# EAGLE design V0p2_Main_PCB2 (EAGLE 6.5.0)
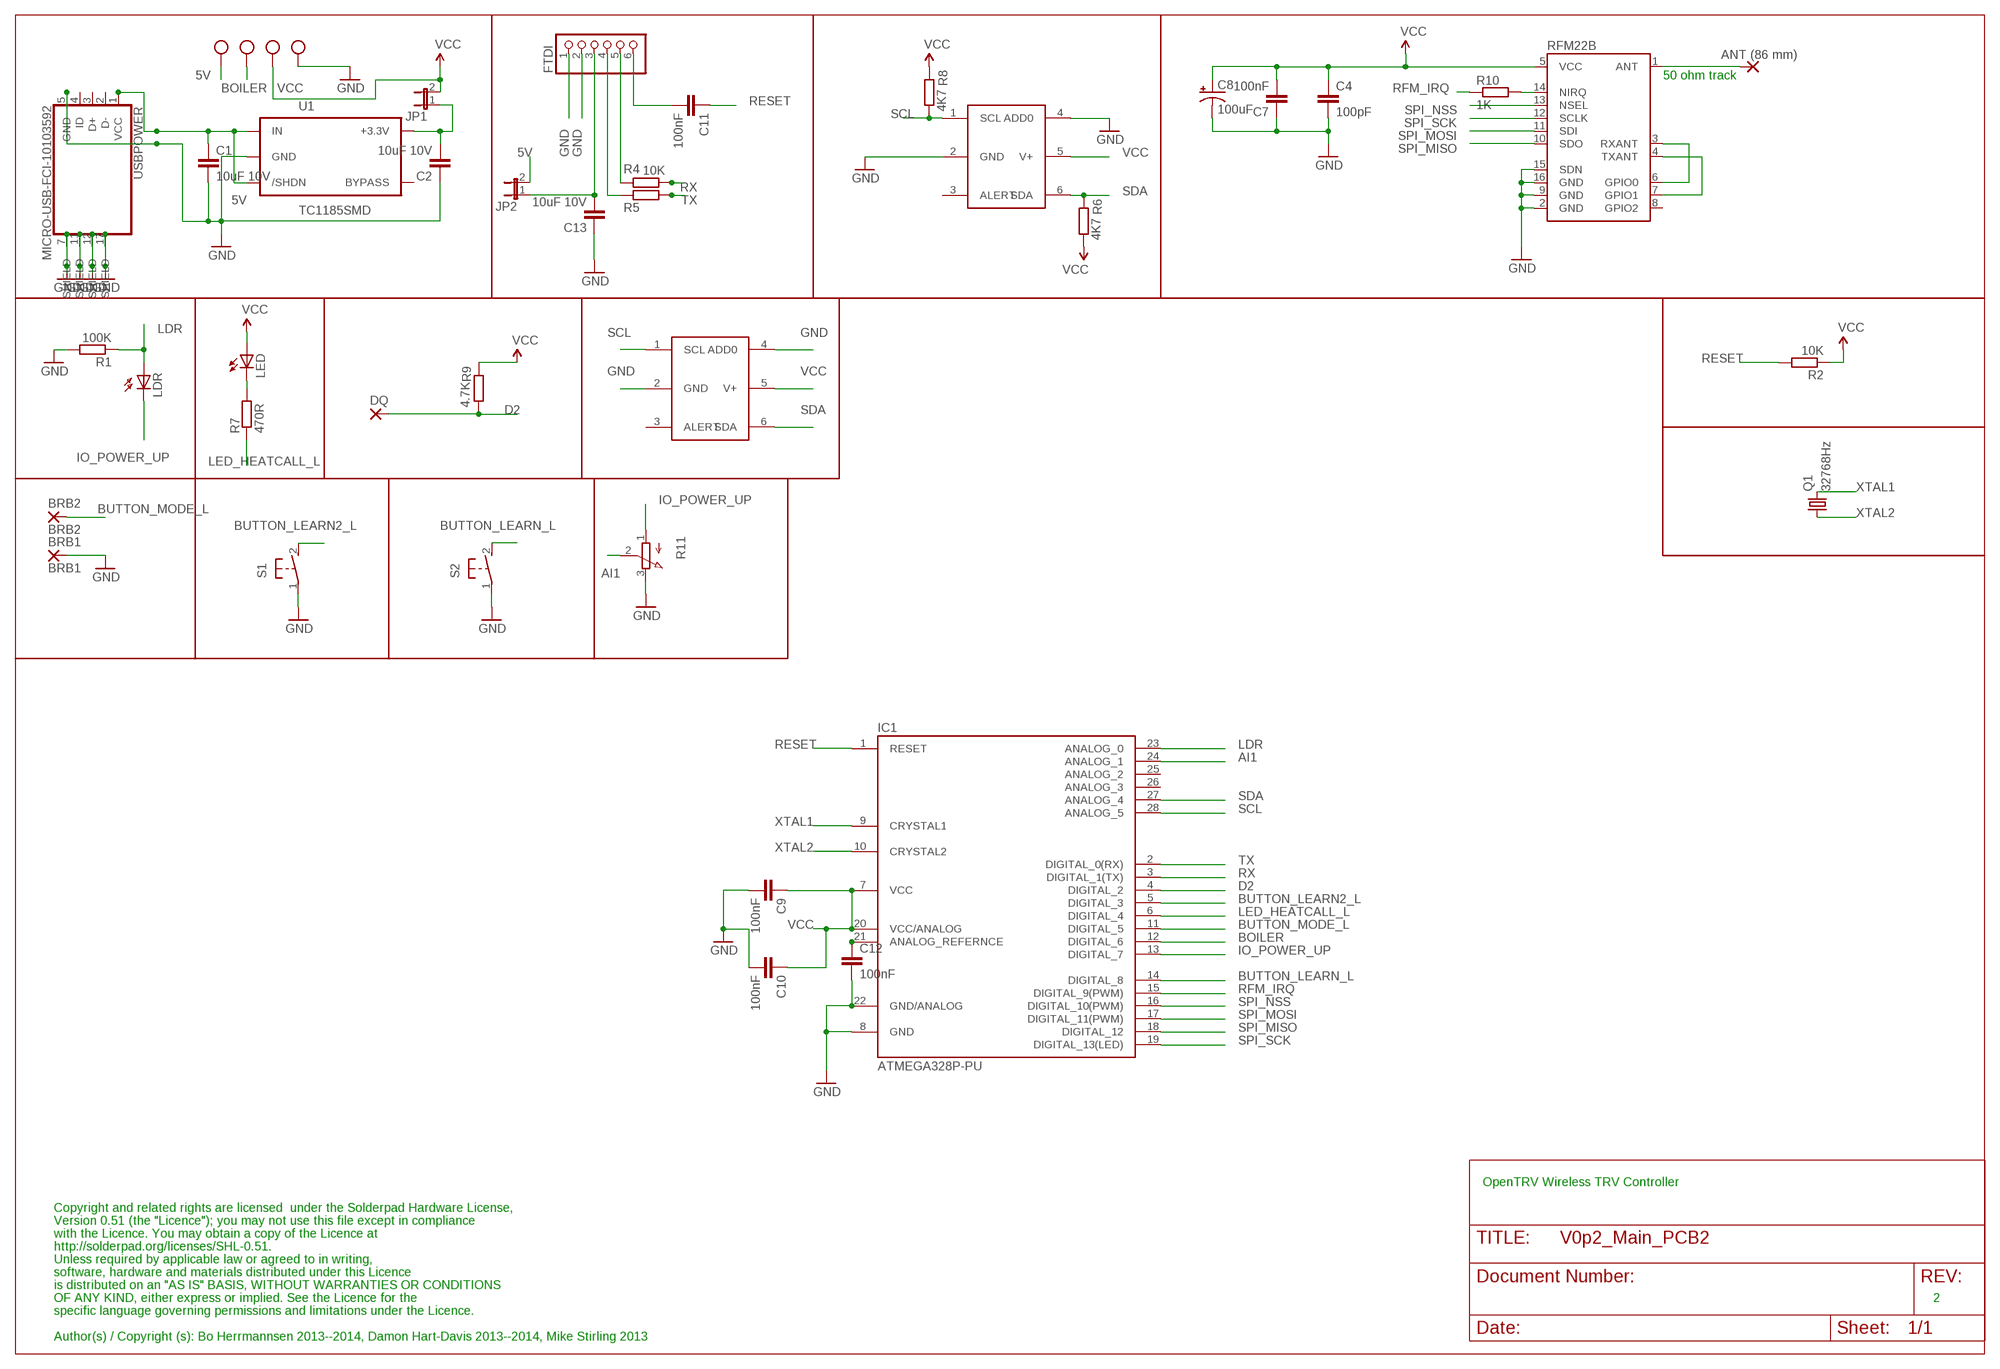
[diagram p0: schematic, sheet 1]

## Parts
ANT  ANT (86 mm)  2,15/1,0  [2,15/1,0]
BRB1  BRB1  2,15/1,0  [2,15/1,0]
BRB2  BRB2  2,15/1,0  [2,15/1,0]
C1  10uF 10V  CAP0603-CAP  [0603-CAP]
C2  10uF 10V  CAP0603-CAP  [0603-CAP]
C4  100pF  CAP0603-CAP  [0603-CAP]
C7  100nF  CAP0603-CAP  [0603-CAP]
C8  100uF  CAP_POL1206  [EIA3216]
C9  100nF  CAP0603-CAP  [0603-CAP]
C10  100nF  CAP0603-CAP  [0603-CAP]
C11  100nF  CAP0603-CAP  [0603-CAP]
C12  100nF  CAP0603-CAP  [0603-CAP]
C13  10uF 10V  CAP0603-CAP  [0603-CAP]
DQ  2,15/1,0  [2,15/1,0]
FTDI  PINHD-1X6/90  [1X06/90]
IC1  ATMEGA328P-PU  ATMEGA8-PU  [DIL28-3]
JP1  JP1E  [JP1]
JP2  JP1E  [JP1]
LDR  BPX65  [BPX65]
LED  LED3MM  [LED3MM]
Q1  32768Hz  MC-306  [MC-306]
R1  100K  R-EU_R0603  [R0603]
R2  10K  R-EU_R0603  [R0603]
R4  10K  R-EU_R0603  [R0603]
R5  10K  R-EU_R0603  [R0603]
R6  4K7  R-EU_R0603  [R0603]
R7  470R  R-EU_R0603  [R0603]
R8  4K7  R-EU_R0603  [R0603]
R9  4.7K  R-EU_R0603  [R0603]
R10  1K  R-EU_R0603  [R0603]
R11  EVUE2A  [EVUE]
RFM22B  RFM22SMD  [RFM22-XXX-S2]
S1  31-XX  [B3F-31XX]
S2  31-XX  [B3F-31XX]
TMP1  TMP1  TMP112  [TMP112]
TMP2  TMP2  TMP112  [TMP112]
U1  TC1185SMD  [TC1185]
USBPOWER  MICRO-USB-FCI-10103592  [MICRO-USB-FCI-10103592]
X1  W237-102  [SCREWTERMINAL]
X2  W237-102  [SCREWTERMINAL]

## Nets
5V [supply]: C1.1 JP2.2 U1.1(IN) U1.3(/SHDN) USBPOWER.1(VCC) X1.2
AI1: IC1.24(ANALOG_1) R11.2(S)
BOILER: IC1.12(DIGITAL_6) X1.1
BUTTON_LEARN2_L: IC1.5(DIGITAL_3) S1.2(S)
BUTTON_LEARN_L: IC1.14(DIGITAL_8) S2.2(S)
BUTTON_MODE_L: BRB2.1(P) IC1.11(DIGITAL_5)
D2: DQ.1(P) IC1.4(DIGITAL_2) R9.1
GND [supply]: BRB1.1(P) C1.2 C2.1 C4.2 C7.1 C8.C(-) C9.2 C10.2 C12.2 C13.1 FTDI.1 FTDI.2 IC1.8(GND) IC1.22(GND/ANALOG) R1.2 R11.3(E) RFM22B.2(GND) RFM22B.9(GND) RFM22B.15(SDN) RFM22B.16(GND) S1.1(P) S2.1(P) TMP1.2(GND) TMP1.4(ADD0) TMP2.2(GND) TMP2.4(ADD0) U1.2(GND) USBPOWER.5(GND) USBPOWER.7(SHIELD) USBPOWER.11(SHIELD) USBPOWER.12(SHIELD) USBPOWER.17(SHIELD) X2.2
IO_POWER_UP [supply]: IC1.13(DIGITAL_7) LDR.K(C) R11.1(A)
LDR: IC1.23(ANALOG_0) LDR.A R1.1
LED_HEATCALL_L: IC1.6(DIGITAL_4) R7.1
N$1: C11.2 FTDI.6
N$3: FTDI.4 R5.2
N$5: FTDI.5 R4.2
N$6 [supply]: C12.1 IC1.21(ANALOG_REFERNCE)
N$7: R10.2 RFM22B.14(NIRQ)
N$8 [supply]: C2.2 JP1.1 U1.5(+3.3V)
N$11 [supply]: C13.2 FTDI.3 JP2.1
N$13: LED.K(C) R7.2
N$20: RFM22B.3(RXANT) RFM22B.6(GPIO0)
N$21: RFM22B.4(TXANT) RFM22B.7(GPIO1)
N$26 [ant]: ANT.1(P) RFM22B.1(ANT)
RESET: C11.1 IC1.1(RESET) R2.2
RFM_IRQ: IC1.15(DIGITAL_9(PWM)) R10.1
RX: IC1.3(DIGITAL_1(TX)) R4.1
SCL: IC1.28(ANALOG_5) R8.1 TMP1.1(SCL) TMP2.1(SCL)
SDA: IC1.27(ANALOG_4) R6.2 TMP1.6(SDA) TMP2.6(SDA)
SPI_MISO: IC1.18(DIGITAL_12) RFM22B.10(SDO)
SPI_MOSI: IC1.17(DIGITAL_11(PWM)) RFM22B.11(SDI)
SPI_NSS: IC1.16(DIGITAL_10(PWM)) RFM22B.13(NSEL)
SPI_SCK: IC1.19(DIGITAL_13(LED)) RFM22B.12(SCLK)
TX: IC1.2(DIGITAL_0(RX)) R5.1
VCC [supply]: C4.1 C7.2 C8.A(+) C9.1 C10.1 IC1.7(VCC) IC1.20(VCC/ANALOG) JP1.2 LED.A R2.1 R6.1 R8.2 R9.2 RFM22B.5(VCC) TMP1.5(V+) TMP2.5(V+) X2.1
XTAL1: IC1.9(CRYSTAL1) Q1.4
XTAL2: IC1.10(CRYSTAL2) Q1.1
Unconnected: IC1.25(ANALOG_2) IC1.26(ANALOG_3) RFM22B.8(GPIO2) TMP1.3(ALERT) TMP2.3(ALERT) U1.4(BYPASS) USBPOWER.2(D-) USBPOWER.3(D+) USBPOWER.4(ID)

## Notes on the sheet
- 50 ohm track
- OpenTRV Wireless TRV Controller
- Copyright and related rights are licensed  under the Solderpad Hardware License,
- Version 0.51 (the "Licence"); you may not use this file except in compliance
- with the Licence. You may obtain a copy of the Licence at
- http://solderpad.org/licenses/SHL-0.51.
- Unless required by applicable law or agreed to in writing,
- software, hardware and materials distributed under this Licence
- is distributed on an "AS IS" BASIS, WITHOUT WARRANTIES OR CONDITIONS
- OF ANY KIND, either express or implied. See the Licence for the | 2
- specific language governing permissions and limitations under the Licence.
- Author(s) / Copyright (s): Bo Herrmannsen 2013--2014, Damon Hart-Davis 2013--2014, Mike Stirling 2013

## Library data of the parts
ANT BRB1 BRB2 DQ = wirepad:2,15/1,0: THROUGH-HOLE PAD
C1 C2 C4 C7 C9-C13 = SparkFun-Passives:CAP: Capacitor Standard 0603 ceramic capacitor, and 0.1" leaded capacitor.
C8 = SparkFun-Passives:CAP_POL: Capacitor Polarized These are standard SMD and PTH capacitors. Normally 10uF, 47uF, and 100uF in electrolytic and tantalum varieties. Always verify the external diameter of the through hole cap, it varies with capacity, voltage, and manufacturer. The EIA devices should be standard.
FTDI = pinhead:PINHD-1X6: PIN HEADER
IC1 = Arduino-AVR:ATMEGA8-PU
JP1 JP2 = jumper:JP1E: JUMPER
LDR = opto-trans-siemens:BPX65: PHOTO DIODE; MPN: BPX65.; OC_FARNELL: 327451; OC_NEWARK: 06WX2764
LED = adafruit:LED: LED OSRAM: - CHIPLED LG R971, LG N971, LY N971, LG Q971, LY Q971, LO R971, LY R971 LH N974, LH R974 LS Q976, LO Q976, LY Q976 LO Q996 - Hyper CHIPLED LW Q18S LB Q993, LB Q99A, LB R99A - SideLED LS A670, LO A670, LY A670, LG A670, LP A670 LB A673, LV A673, LT A673, LW A673 LH A674 LY A675 LS A676, LA A676, LO A676, LY A676, LW A676 LS A679, LY A679, LG A679 - Hyper Micro SIDELED® LS Y876, LA Y876, LO Y876, LY Y876 LT Y87S - SmartLED LW L88C, LW L88S LB L89C, LB L89S, LG L890 LS L89K, LO L89K, LY L89K LS L896, LA L896, LO L896, LY L896 - TOPLED LS T670, LO T670, LY T670, LG T670, LP T670 LSG T670, LSP T670, LSY T670, LOP T670, LYG T670 LG T671, LOG T671, LSG T671 LB T673, LV T673, LT T673, LW T673 LH T674 LS T676, LA T676, LO T676, LY T676, LB T676, LH T676, LSB T676, LW T676 LB T67C, LV T67C, LT T67C, LS T67K, LO T67K, LY T67K, LW E67C LS E67B, LA E67B, LO E67B, LY E67B, LB E67C, LV E67C, LT E67C LW T67C LS T679, LY T679, LG T679 LS T770, LO T770, LY T770, LG T770, LP T770 LB T773, LV T773, LT T773, LW T773 LH T774 LS E675, LA E675, LY E675, LS T675 LS T776, LA T776, LO T776, LY T776, LB T776 LHGB T686 LT T68C, LB T68C - Hyper Mini TOPLED® LB M676 - Mini TOPLED Santana® LG M470 LS M47K, LO M47K, LY M47K Source: http://www.osram.convergy.de/
Q1 = crystal:MC-306: kHz RANGE CRYSTAL UNIT SMD Source: MC-306_405_406_E07X.PDF Homepage <http://www.epsontoyocom.co.jp>; MPN: MC-306 60.0KHZ 100PPM ,12.5PF; OC_FARNELL: 1278040; OC_NEWARK: 31M5576
R1 R2 R4-R10 = resistor:R-EU_: RESISTOR, European symbol
R11 = pot:EVU: 9 mm Square Rotary Potentiometers Source: Panasonic
RFM22B = SparkFun-RF:RFM22: The RFM22 is a low-power, low cost radio that is capable of operating in the 434MHz and 900MHz open bands. It's frequency is software defined and there are some very good libraries written for it.
S1 S2 = adafruit:31-XX: OMRON SWITCH Now with beefier pads!
TMP1 = TMP112:TMP112
TMP2 = TMP112_2:TMP112
U1 = 3.3VREG:TC1185
USBPOWER = micro-usb-fci-10103592:MICRO-USB-FCI-10103592: Micro USB B Connector RS No: 714-2334 MRF No: 10103592-0001LF
X1 X2 = screwterminal:W237-102: Screw terminal 3.5mm Pitch RS No: 710-0444 MRF No:1776275-2; MPN: 237-102; OC_FARNELL: unknown; OC_NEWARK: 70K9898

## Net classes
0 default: width 0.203 mm
1 supply: width 0.406 mm, clearance 0.203 mm
2 ant: width 2.184 mm

## Board
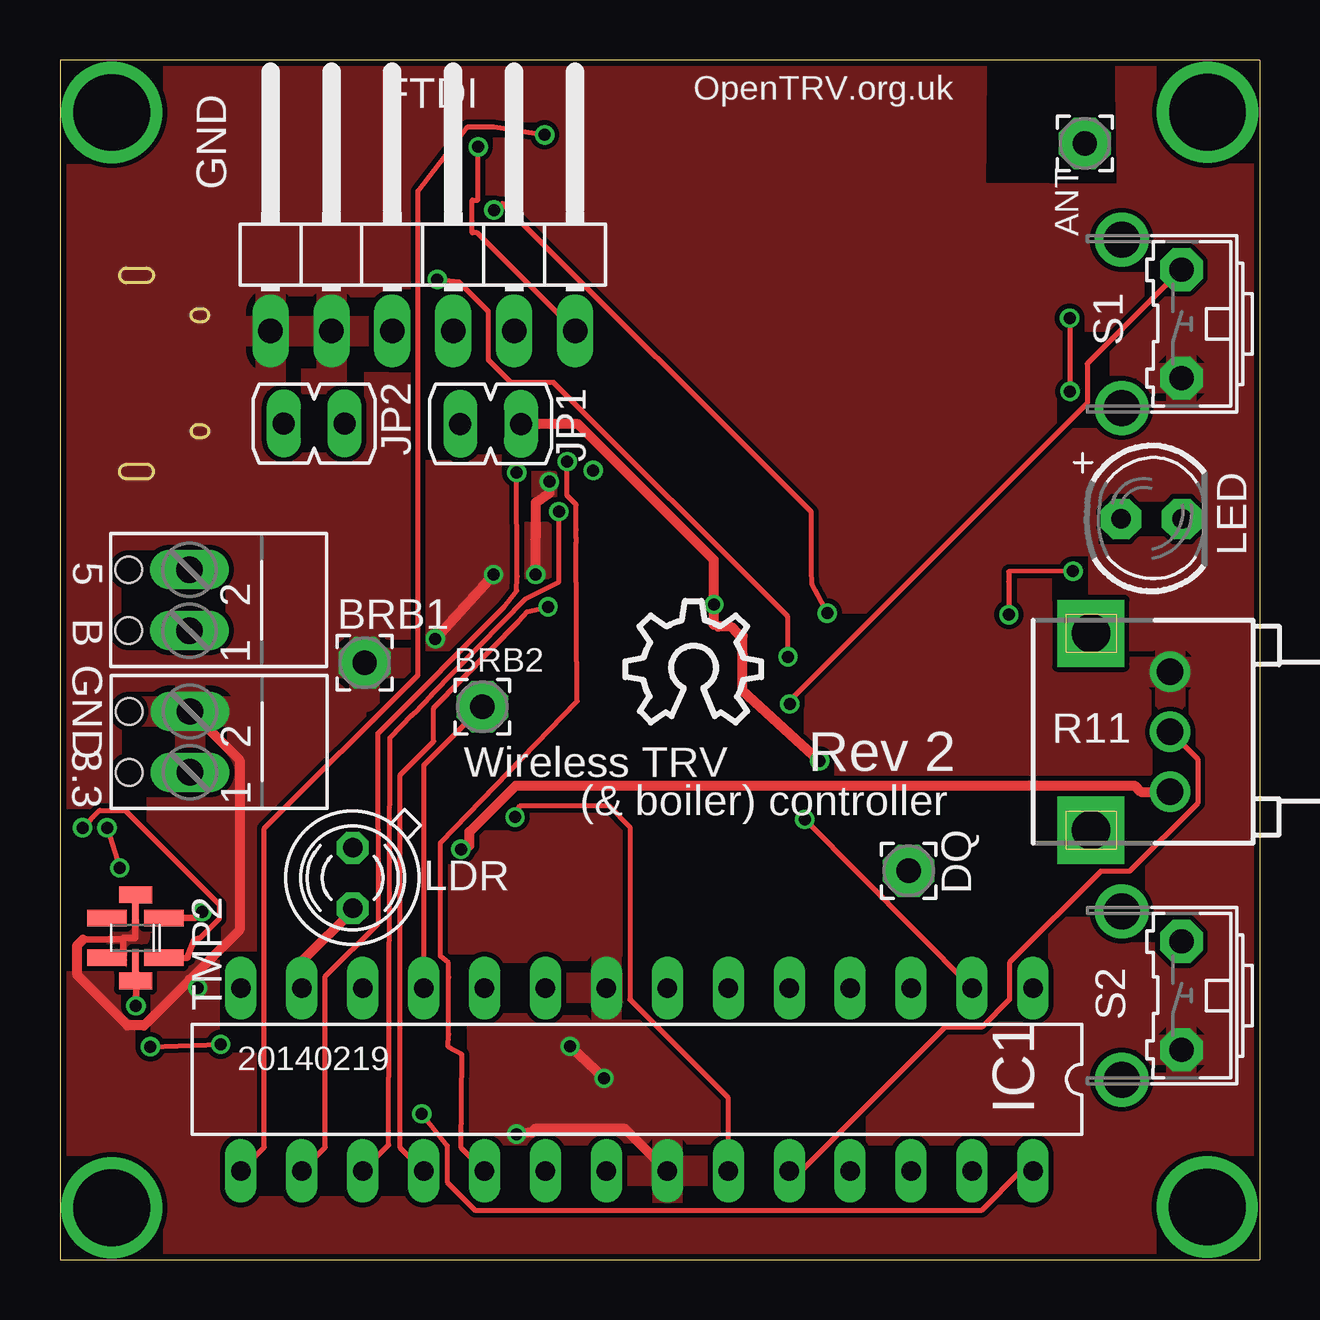
[diagram p1: board, top side]
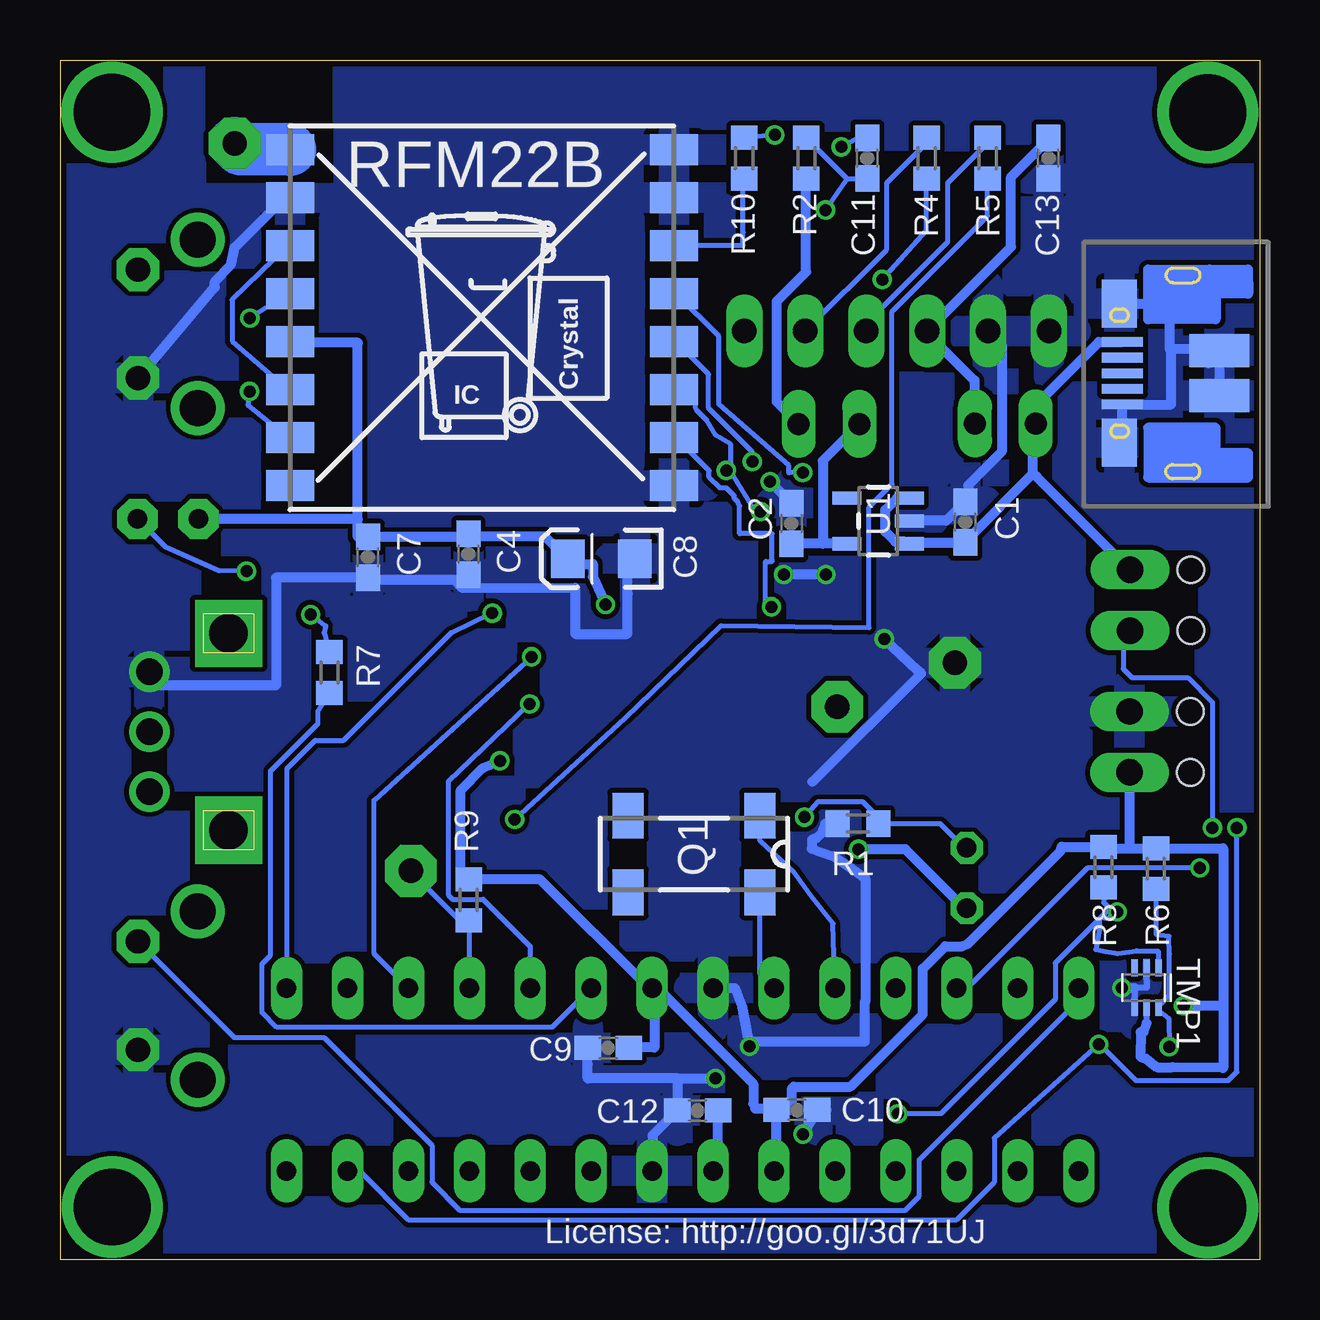
[diagram p2: board, bottom side, seen from below]

Size 50 x 50 mm. Coordinates in mm from the lower left corner, seen from the top.
Outline: 0,0 50,0 50,50 0,50 0,0
Copper layers (1*16): Top 0.035mm / dielectric 1.5mm / Bottom 0.035mm
Design rules "PMServicesStd *": minimum track width 8mil, minimum drill 0.5mm, track to track 8mil, track to pad 8mil, pad to pad 8mil, via to via 8mil, smd to smd 0mil, copper to edge 10mil, drill to drill 10mil, minimum pad ring 10mil, minimum via ring 6mil, stop-mask expansion 2mil, vias tented up to drill 100mil, thermal gap 10mil

### Footprints (pad centres in the part's own frame; a part is rotated, then mirrored left to right if it is on the bottom)
2,15/1,0 = drill 1.016 pad 2.159 octagon: 1 0,0
0603-CAP = smd 1.1 x 1: 1 -0.85,0; 2 0.85,0
EIA3216 = smd 1.4 x 1.6: A 1.4,0; C -1.4,0
1X06/90 = drill 1.016 long: 1 -6.35,-3.81; 2 -3.81,-3.81; 3 -1.27,-3.81; 4 1.27,-3.81; 5 3.81,-3.81; 6 6.35,-3.81
DIL28-3 = drill 0.813 long: 1 -16.51,-3.81; 2 -13.97,-3.81; 3 -11.43,-3.81; 4 -8.89,-3.81; 5 -6.35,-3.81; 6 -3.81,-3.81; 7 -1.27,-3.81; 8 1.27,-3.81; 9 3.81,-3.81; 10 6.35,-3.81; 11 8.89,-3.81; 12 11.43,-3.81; 13 13.97,-3.81; 14 16.51,-3.81; 15 16.51,3.81; 16 13.97,3.81; 17 11.43,3.81; 18 8.89,3.81; 19 6.35,3.81; 20 3.81,3.81; 21 1.27,3.81; 22 -1.27,3.81; 23 -3.81,3.81; 24 -6.35,3.81; 25 -8.89,3.81; 26 -11.43,3.81; 27 -13.97,3.81; 28 -16.51,3.81
JP1 = drill 0.914 long: 1 0,-1.27; 2 0,1.27
BPX65 = drill 0.813 octagon: A -0.889,-0.889; K 0.889,0.889
LED3MM = drill 0.813 pad 1.676 octagon: A -1.27,0; K 1.27,0
MC-306 = smd 1.3 x 1.9: 1 -2.75,-1.6; 2 2.75,-1.6; 3 2.75,1.6; 4 -2.75,1.6
R0603 = smd 1 x 1.1: 1 -0.85,0; 2 0.85,0
EVUE = drill 1.1 pad 1.676: 1 0,-2.5; 2 0,0; 3 0,2.5 | drill 1.6 pad 2.8 square: M1 -3.3,4.1; M2 -3.3,-4.1
RFM22-XXX-S2 = smd 2 x 1.3: 1 -8,7; 2 -8,5; 3 -8,3; 4 -8,1; 5 -8,-1; 6 -8,-3; 7 -8,-5; 8 -8,-7; 9 8,-7; 10 8,-5; 11 8,-3; 12 8,-1; 13 8,1; 14 8,3; 15 8,5; 16 8,7
B3F-31XX = drill 1.016 pad 1.778 octagon: 1 -2.261,-1.245; 2 2.261,-1.245 | drill 1.499 pad 2.032: 3 -3.505,1.245; 4 3.505,1.245
TMP112 = smd 0.285 x 0.7: 1 -0.5,-0.825; 2 0,-0.825; 3 0.5,-0.825; 4 0.5,0.825; 5 0,0.825; 6 -0.5,0.825
TMP112' = smd 0.285 x 0.7: 1 -0.5,-0.825; 2 0,-0.825; 3 0.5,-0.825; 4 0.5,0.825; 5 0,0.825; 6 -0.5,0.825; 7 0.777,-0.825; 8 1.325,-0.825; 9 1.05,-0.825; 10 1.868,-0.826; 11 1.595,-0.826; 12 -1.863,-0.825; 13 -1.314,-0.825; 14 -1.59,-0.825; 15 -0.772,-0.825; 16 -1.044,-0.825; 17 -1.86,0.822; 18 -1.312,0.822; 19 -1.587,0.822; 20 -0.769,0.821; 21 -1.041,0.821; 22 0.766,0.824; 23 1.315,0.824; 24 1.039,0.824; 25 1.857,0.823; 26 1.585,0.823; 27 -0.548,1.797; 28 0,1.797; 29 -0.275,1.797; 30 0.543,1.797; 31 0.271,1.797; 32 0.001,1.383; 33 -0.548,-1.798; 34 0,-1.798; 35 -0.275,-1.798; 36 0.543,-1.799; 37 0.271,-1.799; 38 0,-1.322
TC1185 = smd 0.55 x 1.2: 1 -0.95,-1.3; 2 0,-1.3; 3 0.95,-1.3; 4 0.95,1.3; 5 -0.95,1.3
MICRO-USB-FCI-10103592 = smd 0.4 x 1.71: 1 3.84,2.51; 2 3.19,2.51; 3 2.54,2.51; 4 1.89,2.51; 5 1.24,2.51 | smd 2 x 1.46: 7 -0.36,2.64; 17 5.44,2.64 | smd 1.375 x 2.5: 11 1.603,-1.52; 12 3.478,-1.52
SCREWTERMINAL = drill 1.1 long: 1 -1.27,-1.27; 2 1.27,-1.27 | hole 1.1: -1.27,1.27; 1.27,1.27

### Placement (x,y rotation side)
ANT  42.72,46.52 270 top
BRB1  12.7,24.87 0 top
BRB2  17.6,23.04 180 top
C1  12.27,30.74 90 bottom
C2  19.51,30.68 270 bottom
C4  32.98,29.4 270 bottom
C7  37.16,29.27 90 bottom
C8  27.44,29.21 180 bottom
C9  27.15,8.82 180 bottom
C10  19.28,6.24 0 bottom
C11  16.35,45.91 90 bottom
C12  23.42,6.21 180 bottom
C13  8.8,45.91 90 bottom
DQ  35.38,16.2 0 top
FTDI  15.12,42.52 0 top
IC1  24.05,7.51 180 top
JP1  17.95,34.83 270 top
JP2  10.59,34.85 90 top
LDR  12.2,15.9 225 top
LED  45.5,30.86 0 top
Q1  23.57,16.9 180 bottom
R1  16.74,18.17 180 bottom
R2  18.89,45.91 90 bottom
R4  13.87,45.91 90 bottom
R5  11.33,45.91 90 bottom
R6  4.31,16.29 270 bottom
R7  38.77,24.47 90 bottom
R8  6.5,16.35 90 bottom
R9  32.96,14.99 90 bottom
R10  21.48,45.91 270 bottom
R11  46.27,22 0 top
RFM22B  32.41,39.26 0 bottom
S1  45.5,39 90 top
S2  45.5,11 90 top
TMP1  4.71,11.33 180 bottom
TMP2  TMP2  [TMP112']  3.14,13.41 180 top
U1  15.89,30.79 90 bottom
U$1  [OSHW_10X200_NOTEXT]  23.56,22.38 0 top
U$2  [TONNE]  32.6,36.53 0 bottom
USBPOWER  3.2,34.4 90 bottom
X1  4.13,27.48 90 top
X2  4.15,21.57 90 top

### Tracks (layer width: path | path; a pad name or v marks a point on that pad's centre or on a via)
5V
  Bottom 0.406: U1.3 14.6,31.72 15.12,31.72 15.6,31.24 15.6,30.34 15.18,29.92 14.78,29.92 U1.1 14.54,29.88 C1.1 12.14,30.06 9.46,32.74 | USBPOWER.1 6.7,38.24 9.32,35.62 JP2.2 9.46,34.68 9.46,32.74 | X1.2 5.42,28.76 9.3,32.64 9.46,32.74
AI1
  Top 0.203: IC1.24 30.9,3.7 36.88,9.68 38.42,9.68 39.58,10.84 39.58,12.38 43.38,16.18 44.58,16.18 47.42,19.02 47.42,20.86 R11.2
BOILER  (via drill 0.5)
  Top 0.203: v1.96,18 v2.49,16.33
  Bottom 0.203: v2.49,16.33 7.18,16.32 12.18,11.32 12.6,11.32 IC1.12 | v1.96,18 1.96,23.22 3,24.26 5.32,24.26 5.68,24.62 5.68,25.94 5.42,26.2 X1.1
BUTTON_LEARN2_L  (via drill 0.5)
  Top 0.203: S1.2 42.82,37.34 42.82,35.7 30.38,23.26 v30.42,23.16
  Bottom 0.203: v30.42,23.16 33.82,19.91 33.82,15.2 33.64,15.02 32.36,15.02 30.4,13.06 IC1.5
BUTTON_LEARN_L
  Bottom 0.203: IC1.14 7.54,11.3 7.54,10.8 14.18,4.16 14.18,2.64 14.76,2.06 33.34,2.06 34.5,3.22 34.5,4.76 39,9.26 42.74,9.26 S2.2
BUTTON_MODE_L
  Top 0.203: IC1.11 15.16,20.6 BRB2.1
D2
  Bottom 0.203: IC1.4 32.94,14.04 R9.1 33.06,14.16 33.36,14.16 35.36,16.16 35.36,16.2 DQ.1
GND  (via drill 0.5)
  Top 0.254: TMP2.2 | TMP2.4 2.64,12.67
  Top 0.279: 2.64,12.67 2.64,13.4 | 2.64,13.4 3.14,13.4 TMP2.2 | 0.96,13.34 2.5,13.34 2.64,13.4
  Top 0.406: v19.03,5.23 19.66,5.3 19.8,5.44 23.56,5.44 25.3,3.7 IC1.22 | v21.26,8.89 v22.68,7.55 | v20.4,32.42 20.4,31.94 19.83,31.56 v19.83,28.55 | v15.64,25.87 v18.07,28.55 | 0.96,13.34 0.72,13.1 0.72,11.86 2.82,9.76 3.5,9.76 5.4,11.66 | 5.4,11.66 7.48,13.74 7.48,20.82 5.44,22.86 X2.2 | 5.4,11.66 v5.74,11.32
  Bottom 0.279: TMP1.2 4.71,11.98 4.7,11.34 5.2,11.32 TMP1.4
  Bottom 0.406: RFM22B.2 40.62,44.18 40.72,44.18 42.72,42.18 42.87,41.47 43.55,40.76 43.55,40.52 S1.1 | U1.2 13.06,30.8 C1.2 12.14,31.76 12.14,32.28 10.74,33.68 10.74,38.14 FTDI.2 | USBPOWER.7 5.84,34.06 5.72,34.18 USBPOWER.5 3.68,35.64 3.68,37.97 | 24.24,7.55 28.01,7.55 28.01,8.14 C9.2 | IC1.22 25.3,3.7 25.3,5.18 C12.2 24.24,6.55 24.24,7.55 | 1.46,35.86 USBPOWER.11 | 1.5,35.86 USBPOWER.11 | 1.68,37.58 2.12,37.36 USBPOWER.12 | 37.05,28.42 37.05,28.48 | RFM22B.9 | v20.4,32.42 C2.1 | 26.04,29.25 C8.C | 18.04,6.22 18.42,6.22 C10.2 18.54,6.06 v19.03,5.23 | 18.64,19.91 14.1,24.42 14.24,24.56 v15.64,25.87 | R1.2 18.1,18.16 18.23,17.79 18.43,17.59 18.66,17.5 18.66,17.12 17.76,16.81 17.16,16.41 16.43,15.89 16.43,10.73 16.47,10.73 16.47,9.08 21.26,9.08 v21.26,8.89 21.57,10.54 21.87,11.32 IC1.8 | RFM22B.9 24.26,32.12 RFM22B.9 | RFM22B.9 | RFM22B.9 | 26.12,29.46 26.17,29.41 | 26.17,29.41 26.26,29.32 | 24.24,7.55 v22.68,7.55 | 26.17,29.41 26.16,29.4 C8.C | C8.C 26.34,29.12 26.34,28.9 26.34,27.75 26.35,27.64 26.35,26.08 28.52,26.07 28.52,28 33.22,28 33.56,28.34 36.86,28.34 C7.1 41,28.42 41,23.93 46.27,23.93 R11.3 | 3.68,37.97 1.68,37.97 USBPOWER.12 | 5.84,39.98 USBPOWER.17 | USBPOWER.17 5.82,39.84 | 3.68,37.97 3.75,37.97 3.75,39.84 USBPOWER.17 | USBPOWER.12 USBPOWER.11 | v18.07,28.55 v19.83,28.55 | v5.74,11.32 5.34,11.32 5.2,11.32
  pour Bottom: 0,0 50,0 50,50 44.58,50 44.58,45.56 44.5,45.56 44.55,44.24 37.97,44.26 38,50.03 0,50
  pour Top: 0,50 0,0 50,0 50,50 44.6,50 44.7,44.28 44.51,44.21 37.97,44.26 38.01,49.96 37.35,49.96
IO_POWER_UP  (via drill 0.5)
  Top 0.406: IC1.13 10.08,12.42 12.3,14.64 LDR.K | R11.1 45.06,19.5 44.8,19.76 19,19.76 17.07,17.83 17.07,17.24 16.71,17.24 v16.71,17.1
  Bottom 0.406: v16.71,17.1 14.76,17.1 12.32,14.66 LDR.K
LDR  (via drill 0.5)
  Top 0.203: v18.97,18.44 19.18,18.92 22.86,18.92 23.76,18.02 23.76,10.84 27.84,6.76 27.84,3.7 IC1.23
  Bottom 0.203: LDR.A 12.32,17.18 13.3,18.16 R1.1 15.88,18.26 15.88,18.42 16.54,19.08 18.42,19.08 v18.97,18.44
LED_HEATCALL_L
  Bottom 0.203: R7.1 39.24,22.86 39.24,22.34 41.22,20.36 41.22,12.68 41.58,12.32 41.58,10.3 40.96,9.68 29.48,9.68 27.86,11.3 IC1.6
N$1  (via drill 0.5)
  Top 0.203: v17.43,46.38 17.42,44.36 17.42,44.16 17.18,44.16 17.18,42.8 17.38,42.8 FTDI.6
  Bottom 0.203: v17.43,46.38 16.76,46.74 16.36,46.74 C11.2
N$3
  Bottom 0.203: R5.2 11.34,46.74 11.34,46.54 13,44.88 13,42.42 16.38,39.04 FTDI.4
N$4  (via drill 3.2)
  other vias: 2.16,47.81
N$5
  Bottom 0.203: R4.2 13.88,46.74 13.88,46.54 15.54,44.88 15.54,42.1 FTDI.5
N$6
  Bottom 0.406: C12.1 22.58,3.88 22.76,3.7 IC1.21
N$7
  Bottom 0.203: R10.2 21.48,45.04 21.54,45.04 21.53,42.82 21.53,42.28 24.4,42.28 RFM22B.14
N$8
  Bottom 0.406: 18.2,29.84 U1.5 | 18.2,29.84 C2.2 | 18.2,29.84 18.2,33.3 JP1.1
N$11
  Bottom 0.406: C13.2 8.8,46.74 8.8,46.68 10.36,45.12 10.36,42.2 FTDI.3 13.76,38.52 11.88,36.64 11.88,34.86 JP2.1
N$12  (via drill 3.2)
  other vias: 47.83,2.19
N$13  (via drill 0.5)
  Top 0.203: v42.23,28.69 39.55,28.68 39.55,28.25 v39.55,26.88
  Bottom 0.203: LED.K 45.62,29.72 43.36,28.71 v42.23,28.69 | v39.55,26.88 38.92,26.41 38.99,26.13 R7.2
N$19  (via drill 3.2)
  other vias: 47.83,47.82
N$20
  Bottom 0.203: RFM22B.6 40.42,36.28 40.52,36.28 42.81,38.28 42.83,40 40.5,42.26 RFM22B.3
N$21  (via drill 0.5)
  Top 0.203: v42.08,39.24 v42.1,36.19
  Bottom 0.203: v42.1,36.19 42.16,36.15 42.16,35.62 40.52,34.28 40.42,34.28 RFM22B.7 | v42.08,39.24 40.5,40.26 RFM22B.4
N$22  (via drill 3.2)
  other vias: 2.16,2.16
N$26
  Bottom 2.184: RFM22B.1 40.42,46.28 42.46,46.28 42.7,46.52 ANT.1
RESET  (via drill 0.5)
  Top 0.203: v18.09,43.75 18.44,44.02 31.31,31.16 31.31,28.76 31.35,28.14 v31.98,26.94
  Bottom 0.203: 17.2,45.06 C11.1 | 17.2,45.06 18.88,46.74 R2.2 | v18.09,43.75 17.24,44.96 17.2,45.06 | v31.98,26.94 33.7,26.12 38.18,21.64 39.36,21.64 40.54,20.46 40.54,11.32 IC1.1
RFM_IRQ  (via drill 0.5)
  Top 0.203: v20.2,46.88 18.09,47.22 17.96,47.21 16.99,47.21 14.92,44.54 14.92,24.36 8.52,17.96 8.52,4.68 IC1.15
  Bottom 0.203: v20.2,46.88 21.46,46.74 R10.1
RX  (via drill 0.5)
  Top 0.203: v15.73,40.85 16.64,40.74 17.86,39.52 17.86,37.5 18.8,36.56 20.58,36.56 30.34,26.8 v30.35,25.12
  Bottom 0.203: v15.73,40.85 13.88,42.88 13.88,45.04 R4.1 | v30.35,25.12 36.91,19.14 36.9,12.74 IC1.3
SCL  (via drill 0.5)
  Top 0.203: v15.08,6.07 16.14,4.74 16.14,3.22 17.3,2.06 38.42,2.06 40.04,3.68 40.54,3.68 IC1.28
  Top 0.279: TMP2.1 5.62,14.23 5.62,14.24 v5.93,14.49
  Bottom 0.203: 6.25,14.63 6.5,14.88 R8.1 | 6.25,14.63 6.56,14.3 | 6.56,14.3 6.69,14.17 6.69,13.75 6.83,12.92 6.42,12.84 5.91,12.76 5.12,12.87 4.22,12.86 TMP1.1 | v15.08,6.07 13.28,6.08 8.52,10.84 8.52,12.36 6.25,14.63 | v5.93,14.49 6.31,14.23 6.5,14.24 6.56,14.3
SDA  (via drill 0.5)
  Top 0.203: v3.77,8.87 v6.7,8.97 | v0.94,18 1.66,18.72 2.72,18.72 6.64,14.8 6.64,14.2 5.82,13.38 5.74,13.38 5.62,13.34
  Top 0.254: TMP2.6 5.32,12.58 5.32,12.62 5.62,13.34
  Bottom 0.203: TMP1.6 | R6.2 4.3,15.42 4.3,13.54 3.77,13.47 3.76,12.72 3.76,11.02 4.18,10.6 TMP1.6 | v3.77,8.87 3.79,10.05 4.24,10.4 TMP1.6 | IC1.27 38,3.68 37.5,3.68 35.46,1.64 12.64,1.64 11.06,3.22 11.06,5.06 v6.7,8.97 6.62,8.92 5.16,7.46 1.3,7.46 0.94,7.82 v0.94,18
SPI_MISO  (via drill 0.5)
  Top 0.203: v20.34,27.2 19.48,27.01 19.12,26.6 15.58,22.98 15.58,21.6 14.18,20.2 14.18,4.66 15.14,3.7 IC1.18
  Bottom 0.203: v20.34,27.2 20.58,27.2 20.58,29.1 20.32,29.1 20.32,29.14 20.32,30.26 21.67,30.25 21.67,31.41 21.72,31.5 21.72,31.54 21.74,31.56 21.74,31.58 21.9,31.74 21.9,31.84 22.22,32.16 22.5,32.16 22.94,32.6 22.94,32.88 24.32,34.26 RFM22B.10
SPI_MOSI  (via drill 0.5)
  Top 0.203: IC1.17 13.7,4.78 13.75,21.74 14.68,22.7 14.75,22.77 15.48,23.51 19.42,27.54 20.8,28.24 v20.8,31.18
  Bottom 0.203: 22.03,33.18 22.03,32.82 21.04,31.24 21.04,31.18 v20.8,31.18 | 22.03,33.18 22.03,33.94 22.08,34.02 22.69,34.37 23.05,34.99 23.46,35.4 23.51,35.48 23.51,36.26 RFM22B.11 | v22.23,32.89 22.03,33.18
SPI_NSS  (via drill 0.5)
  Top 0.203: v19.04,32.8 19.05,28.47 19.04,27.87 18.5,27.21 13.25,21.93 13.28,14.02 11.06,11.8 11.06,4.68 IC1.16
  Bottom 0.203: v19.04,32.8 19.62,32.8 19.62,33.09 22.54,35.64 22.54,38.48 24.32,40.26 RFM22B.13
SPI_SCK  (via drill 0.5)
  Top 0.203: IC1.19 17.68,3.7 16.72,4.66 16.76,8.55 16.18,8.87 16.21,9.39 16.21,11.78 16.2,12.36 15.86,12.64 15.86,17.36 21.56,23.27 21.52,29.89 21.51,30.1 21.52,30.42 21.52,31.46 21.14,31.84 v21.14,33.26
  Bottom 0.203: v21.14,33.26 21.14,33.66 22.96,35.48 22.96,36.9 24.32,38.26 RFM22B.12
TX  (via drill 0.5)
  Top 0.203: v31.05,18.35 38,11.32 IC1.2
  Bottom 0.203: v31.05,18.35 26.46,22.57 22.44,26.42 16.28,26.34 16.28,31.36 15.32,32.32 15.32,39.52 11.34,43.5 11.34,45.04 R5.1
VCC  (via drill 0.5)
  Top 0.279: TMP2.5 3.15,12.58 3.17,11.43 v3.16,10.57
  Top 0.406: JP1.2 21.6,34.82 27.26,29.16 v27.26,27.3 27.25,26.46 27.44,26.38 27.96,26.38 28.26,26.08 28.45,26 28.45,25.21 28.45,23.73 v31.66,20.79
  Bottom 0.254: TMP1.5 4.71,10.45 4.71,9.85
  Bottom 0.406: R2.1 18.9,45.04 18.9,41.16 20.12,39.94 20.12,35.74 JP1.2 | C10.1 20.14,6.22 20.14,3.78 20.22,3.7 IC1.20 | IC1.7 25.3,11.3 25.22,11.22 25.22,8.84 26.3,8.84 C9.1 | 37.58,30.86 37.58,30.12 C7.2 36.96,30.12 33.16,30.12 C4.1 32.8,30.14 29.78,30.14 29,29.36 C8.A 28.64,29.14 28.5,29 27.79,29 27.79,28.46 v27.26,27.3 | 37.58,30.86 37.58,38.21 40.41,38.21 RFM22B.5 | 37.58,30.86 LED.A | 5.42,17.14 6.44,17.14 R8.2 6.72,17.2 8.24,17.2 8.32,17 12.18,13.14 12.38,13.06 13.1,13.06 14.04,12.12 14.04,10.22 17.06,7.2 19.42,7.2 19.48,7.14 19.48,6.26 19.5,6.24 19.92,6.24 C10.1 | 5.42,17.14 R6.1 | R6.1 | 5.42,17.14 X2.1 | C10.1 20.34,6.3 21.02,6.3 21.1,6.5 21.1,7.32 25.02,11.24 IC1.7 | IC1.7 25.52,11.38 29.98,15.84 R9.2 33.16,15.84 33.3,15.84 33.3,19.56 32.38,20.48 v31.66,20.79 | 4.71,9.85 4.84,9.48 4.95,9.48 4.96,8.45 4.73,8.38 4.27,8.02 3.63,8.02 1.51,7.99 1.52,10.58 | R6.1 1.51,17.14 1.52,10.58 | 1.52,10.58 v3.17,10.58 v3.16,10.57
XTAL1
  Bottom 0.203: Q1.4 20.82,11.9 IC1.9
XTAL2
  Bottom 0.203: Q1.1 20.82,17.44 19.38,16.11 18.67,15.13 17.78,14.01 IC1.10

### Text on the board
bPlace: License: http://goo.gl/3d71UJ
tNames: OpenTRV.org.uk | GND | 5 | B | GND | Rev 2 | 3.3 | Wireless TRV | (& boiler) controller | 20140219